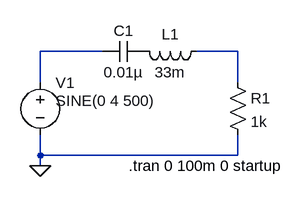
[diagram p0: schematic Series_RLC.asc]
Series_RLC.asc, the LTspice schematic file:
Version 4
SHEET 1 880 680
WIRE 96 80 0 80
WIRE 304 80 240 80
WIRE 0 128 0 80
WIRE 304 128 304 80
WIRE 0 240 0 208
WIRE 304 240 304 208
WIRE 304 240 0 240
WIRE 0 256 0 240
FLAG 0 256 0
SYMBOL voltage 0 112 R0
WINDOW 3 24 44 Left 2
WINDOW 123 0 0 Left 0
WINDOW 39 0 0 Left 0
SYMATTR InstName V1
SYMATTR Value SINE(0 4 500)
SYMBOL cap 160 64 R90
WINDOW 0 0 32 VBottom 2
WINDOW 3 32 32 VTop 2
SYMATTR InstName C1
SYMATTR Value 0.01µ
SYMBOL ind 256 64 R90
WINDOW 0 5 56 VBottom 2
WINDOW 3 32 56 VTop 2
SYMATTR InstName L1
SYMATTR Value 33m
SYMBOL res 288 112 R0
SYMATTR InstName R1
SYMATTR Value 1k
TEXT 136 256 Left 2 !.tran 0 100m 0 startup

The netlist it stands for:
* Series_RLC.asc
V1 N001 0 SINE(0 4 500)
C1 P001 N001 0.01µ
L1 N002 P001 33m
R1 N002 0 1k
.tran 0 100m 0 startup
.backanno
.end